# EAGLE design Charger Control Board rev3 (EAGLE 9.5.2)
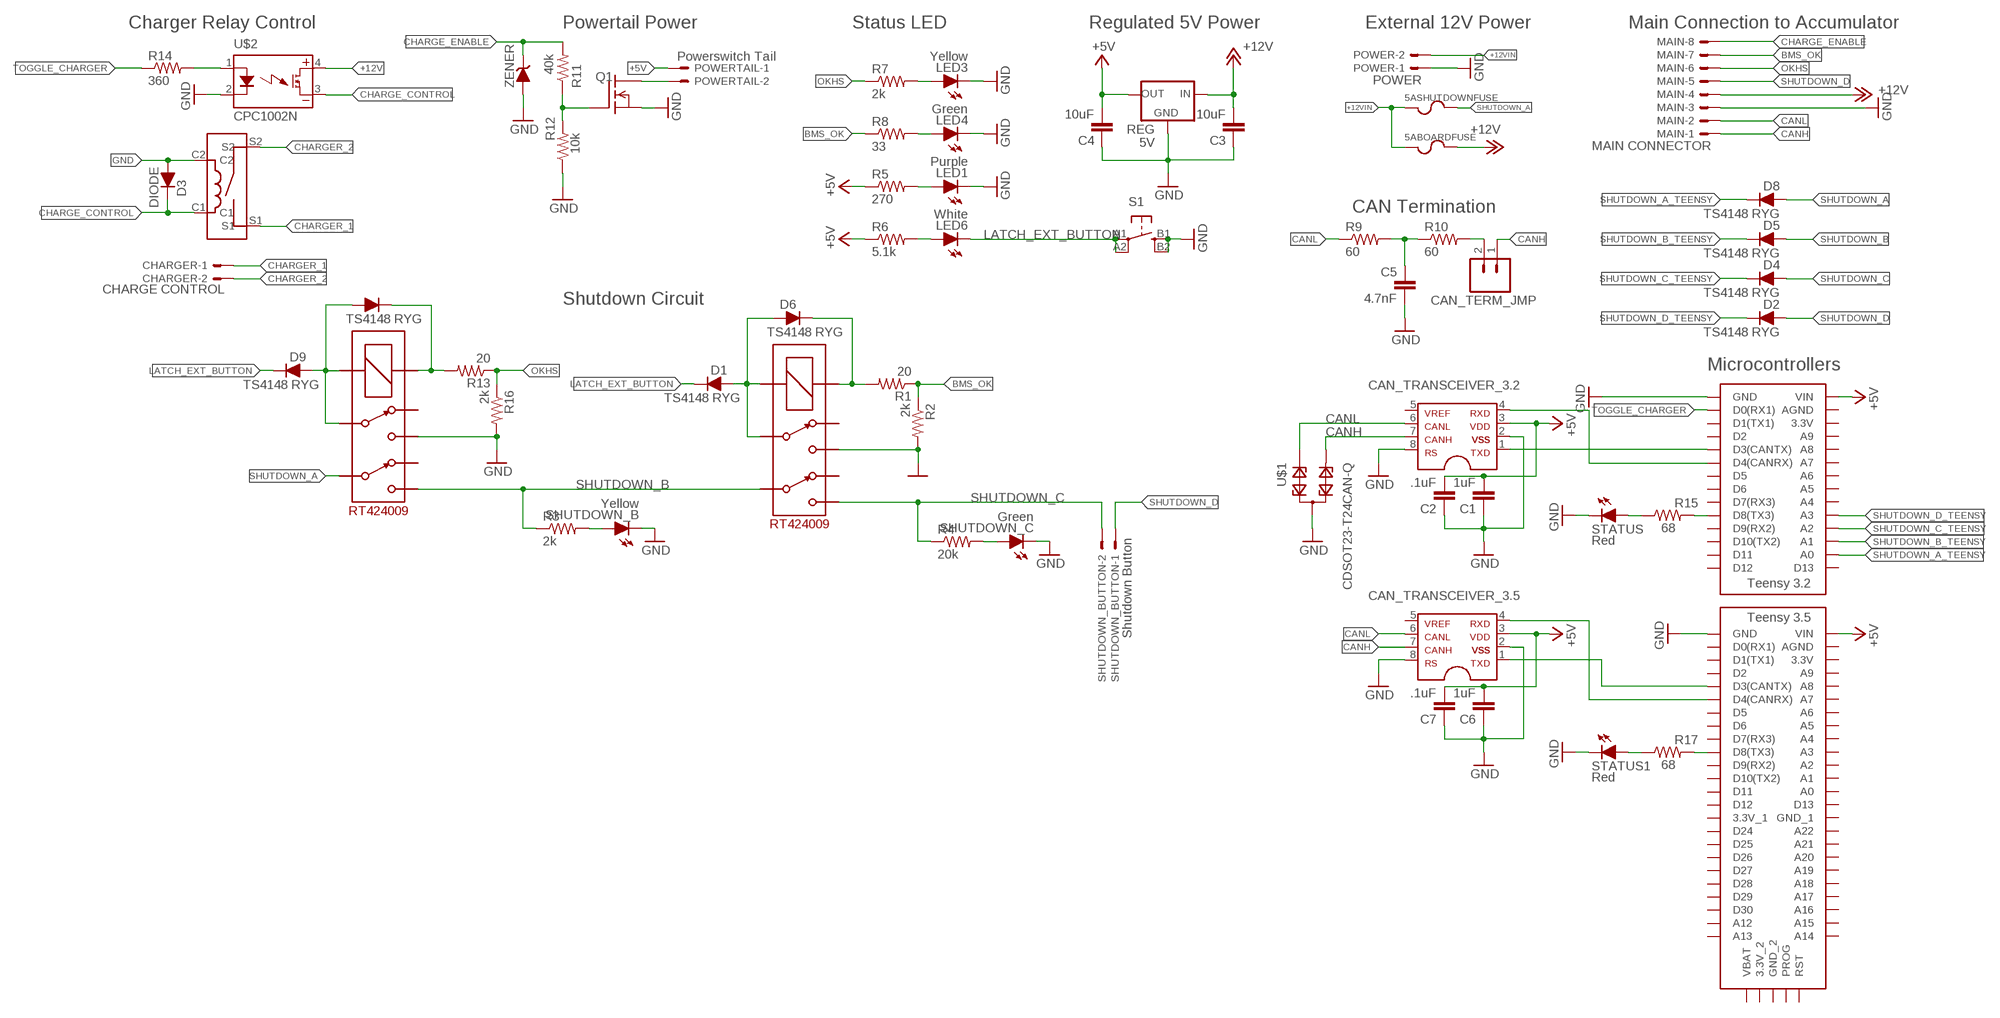
[diagram p0: schematic, sheet 1]

## Parts
5ABOARDFUSE  FUSE_MINIBLADE  [MINI-BLADE_FUSE_HOLDER]
5ASHUTDOWNFUSE  FUSE_MINIBLADE  [MINI-BLADE_FUSE_HOLDER]
BMS_SHUTDOWN_RLY  RT424009  [RELAY_DPDT]
C1  1uF  CAP0805  [0805]
C2  .1uF  CAP0805  [0805]
C3  10uF  CAP0805  [0805]
C4  10uF  CAP0805  [0805]
C5  4.7nF  CAP0805  [0805]
C6  1uF  CAP0805  [0805]
C7  .1uF  CAP0805  [0805]
CAN_TERM_JMP  M02_SLIM  [1X02_SLIM]
CAN_TRANSCEIVER_3.2  MCP2551  [SOIC-08]
CAN_TRANSCEIVER_3.5  MCP2551  [SOIC-08]
CHARGER  CHARGE CONTROL  CONNECTOR-2NANO-FIT_VERTICAL-2  [NANO-FIT_VERTICAL-2]
D1  TS4148 RYG  DIODE0805  [0805_D]
D2  TS4148 RYG  DIODE0805  [0805_D]
D3  DIODE  DIODE0805  [0805_D]
D4  TS4148 RYG  DIODE0805  [0805_D]
D5  TS4148 RYG  DIODE0805  [0805_D]
D6  TS4148 RYG  DIODE0805  [0805_D]
D7  TS4148 RYG  DIODE0805  [0805_D]
D8  TS4148 RYG  DIODE0805  [0805_D]
D9  TS4148 RYG  DIODE0805  [0805_D]
IMD_SHUTDOWN_RLY  RT424009  [RELAY_DPDT]
LED1  Purple  LED-0805  [LED-805]
LED3  Yellow  LED-0805  [LED-805]
LED4  Green  LED-0805  [LED-805]
LED6  White  LED-0805  [LED-805]
MAIN  MAIN CONNECTOR  CONNECTOR-8NANO-FIT_VERTICAL-8  [NANO-FIT_VERTICAL-8]
POWER  POWER  CONNECTOR-2NANO-FIT_VERTICAL-2  [NANO-FIT_VERTICAL-2]
POWERTAIL  Powerswitch Tail  CONNECTOR-2NANO-FIT_VERTICAL-2  [NANO-FIT_VERTICAL-2]
Q1  DMG3406LSOT  [SOT23]
R1  20  RESISTOR0805-RES  [0805]
R2  2k  RESISTOR0805-RES  [0805]
R3  2k  RESISTOR0805-RES  [0805]
R4  20k  RESISTOR0805-RES  [0805]
R5  270  RESISTOR0805-RES  [0805]
R6  5.1k  RESISTOR0805-RES  [0805]
R7  2k  RESISTOR0805-RES  [0805]
R8  33  RESISTOR0805-RES  [0805]
R9  60  RESISTOR0805-RES  [0805]
R10  60  RESISTOR0805-RES  [0805]
R11  40k  RESISTOR0805-RES  [0805]
R12  10k  RESISTOR0805-RES  [0805]
R13  20  RESISTOR0805-RES  [0805]
R14  360  RESISTOR0805-RES  [0805]
R15  68  RESISTOR0805-RES  [0805]
R16  2k  RESISTOR0805-RES  [0805]
R17  68  RESISTOR0805-RES  [0805]
REG  5V  OKI-78SR-5  [OKI-78SR]
S1  BTN_10-XXSMD  [TACTILE_SWITCH_SMD_6.2MM_TALL]
SHUTDOWN_B  Yellow  LED-0805  [LED-805]
SHUTDOWN_BUTTON  Shutdown Button  CONNECTOR-2NANO-FIT_VERTICAL-2  [NANO-FIT_VERTICAL-2]
SHUTDOWN_C  Green  LED-0805  [LED-805]
STATUS  Red  LED-0805  [LED-805]
STATUS1  Red  LED-0805  [LED-805]
U$1  CDSOT23-T24CAN-Q  [SOT23]
U$2  CPC1002N  [SOP04]
U$3  KT12-1A-40L-THT  [KT12-1A-40L-THT]
U$4  TEENSY_3.2_SIMPLE  [TEENSY_3.2_SIMPLE]
U$5  TEENSY_3.5_EXT  [TEENSY_3.5_EXT]
ZENER  DIODE_ZENER  [SOT23]

## Nets
+5V: C1.2 C2.2 C4.2 C6.2 C7.2 CAN_TRANSCEIVER_3.2.3 CAN_TRANSCEIVER_3.5.3 POWERTAIL.P$1 R5.1 R6.1 REG.3(OUT) U$4.VIN U$5.VIN
+12V: 5ABOARDFUSE.R1 5ABOARDFUSE.R2 C3.2 MAIN.P$4 REG.1(IN) U$2.4(DC+)
+12VIN: 5ABOARDFUSE.L1 5ABOARDFUSE.L2 5ASHUTDOWNFUSE.L1 5ASHUTDOWNFUSE.L2 POWER.P$2
BMS_OK: MAIN.P$7 R1.1 R2.1 R8.1
BMS_OK_RELAY: BMS_SHUTDOWN_RLY.COIL+ D6.C R1.2
BMS_PWR_STEP: BMS_SHUTDOWN_RLY.3 BMS_SHUTDOWN_RLY.COIL- D1.A D6.A
CANH: CAN_TERM_JMP.1 CAN_TRANSCEIVER_3.2.7 CAN_TRANSCEIVER_3.5.7 MAIN.P$1 U$1.2
CANL: CAN_TRANSCEIVER_3.2.6 CAN_TRANSCEIVER_3.5.6 MAIN.P$2 R9.1 U$1.1
CHARGE_CONTROL: D3.C U$2.3(DC-) U$3.C1
CHARGE_ENABLE: MAIN.P$8 R11.2 ZENER.3(C)
CHARGER_1: CHARGER.P$1 U$3.S1
CHARGER_2: CHARGER.P$2 U$3.S2
GND: C1.1 C2.1 C3.1 C4.1 C5.2 C6.1 C7.1 CAN_TRANSCEIVER_3.2.2 CAN_TRANSCEIVER_3.2.8 CAN_TRANSCEIVER_3.5.2 CAN_TRANSCEIVER_3.5.8 D3.A LED1.C LED3.C LED4.C MAIN.P$3 POWER.P$1 Q1.2(S) R12.1 REG.2(GND) S1.B1(S) S1.B2(S1) SHUTDOWN_B.C SHUTDOWN_C.C STATUS1.C STATUS.C U$1.3 U$2.2(CONTROL-) U$3.C2 U$4.GND U$5.GND ZENER.1(A)
IMD_PWR_STEP: D7.A D9.A IMD_SHUTDOWN_RLY.3 IMD_SHUTDOWN_RLY.COIL-
LATCH_EXT_BUTTON: D1.C D9.C LED6.C S1.A1(P) S1.A2(P1)
N$1: POWERTAIL.P$2 Q1.3(D)
N$2: LED6.A R6.2
N$3: LED4.A R8.2
N$4: CAN_TRANSCEIVER_3.5.4 U$5.D4(CANRX)
N$5: Q1.1(G) R11.1 R12.2
N$6: CAN_TRANSCEIVER_3.5.1 U$5.D3(CANTX)
N$7: R17.1 STATUS1.A
N$8: R15.1 STATUS.A
N$9: R17.2 U$5.D8(TX3)
N$10: R14.2 U$2.1(CONTROL+)
N$11: R15.2 U$4.D8(TX3)
N$12: D7.C IMD_SHUTDOWN_RLY.COIL+ R13.2
N$15: CAN_TRANSCEIVER_3.2.4 U$4.D4(CANRX)
N$17: CAN_TERM_JMP.2 R10.2
N$19: R3.2 SHUTDOWN_B.A
N$22: CAN_TRANSCEIVER_3.2.1 U$4.D3(CANTX)
N$26: LED3.A R7.2
N$29: LED1.A R5.2
N$32: R4.2 SHUTDOWN_C.A
N$60: BMS_SHUTDOWN_RLY.4 IMD_SHUTDOWN_RLY.4 R2.2 R16.2 ; supply symbol labelled GND
N$62: C5.1 R9.2 R10.1
OKHS: MAIN.P$6 R7.1 R13.1 R16.1
SHUTDOWN_A: 5ASHUTDOWNFUSE.R1 5ASHUTDOWNFUSE.R2 D8.A IMD_SHUTDOWN_RLY.6
SHUTDOWN_A_TEENSY: D8.C U$4.A0
SHUTDOWN_B: BMS_SHUTDOWN_RLY.6 D5.A IMD_SHUTDOWN_RLY.5 R3.1
SHUTDOWN_B_TEENSY: D5.C U$4.A1
SHUTDOWN_C: BMS_SHUTDOWN_RLY.5 D4.A R4.1 SHUTDOWN_BUTTON.P$2
SHUTDOWN_C_TEENSY: D4.C U$4.A2
SHUTDOWN_D: D2.A MAIN.P$5 SHUTDOWN_BUTTON.P$1
SHUTDOWN_D_TEENSY: D2.C U$4.A3
TOGGLE_CHARGER: R14.1 U$4.D0(RX1)
Unconnected: BMS_SHUTDOWN_RLY.2 BMS_SHUTDOWN_RLY.7 CAN_TRANSCEIVER_3.2.5 CAN_TRANSCEIVER_3.5.5 IMD_SHUTDOWN_RLY.2 IMD_SHUTDOWN_RLY.7 U$4.3.3V U$4.A4 U$4.A5 U$4.A6 U$4.A7 U$4.A8 U$4.A9 U$4.AGND U$4.D1(TX1) U$4.D2 U$4.D5 U$4.D6 U$4.D7(RX3) U$4.D9(RX2) U$4.D10(TX2) U$4.D11 U$4.D12 U$4.D13 U$5.3.3V U$5.3.3V_1 U$5.3.3V_2 U$5.A0 U$5.A1 U$5.A2 U$5.A3 U$5.A4 U$5.A5 U$5.A6 U$5.A7 U$5.A8 U$5.A9 U$5.A12 U$5.A13 U$5.A14 U$5.A15 U$5.A16 U$5.A17 U$5.A18 U$5.A19 U$5.A20 U$5.A21 U$5.A22 U$5.AGND U$5.D0(RX1) U$5.D1(TX1) U$5.D2 U$5.D5 U$5.D6 U$5.D7(RX3) U$5.D9(RX2) U$5.D10(TX2) U$5.D11 U$5.D12 U$5.D13 U$5.D24 U$5.D25 U$5.D26 U$5.D27 U$5.D28 U$5.D29 U$5.D30 U$5.GND_1 U$5.GND_2 U$5.PROG U$5.RST U$5.VBAT

## Notes on the sheet
- Charger Relay Control | Powertail Power | Status LED | Regulated 5V Power | External 12V Power | Main Connection to Accumulator
- CAN Termination
- Shutdown Circuit
- Microcontrollers

## Library data of the parts
5ABOARDFUSE 5ASHUTDOWNFUSE = HyTechDevices:FUSE: Fuse/Fuseclips Keystone Electronics 3568 Fuse Mouser Part <http://www.mouser.com/ProductDetail/Keystone-Electronics/3568> Datasheet <http://www.mouser.com/ds/2/215/568-742601.pdf> Bussman/Eaton Midget Fuse Clip 1A3400 <http://www.mouser.com/ProductDetail/Bussmann-Eaton/BK-1A3400-09-R/?qs=sGAEpiMZZMuG%252bgnN5hGYGzzlAelq2OxnKqVSMVjq8I4%3d> Schurter 0751.0110 Brass Fuse Clip Datasheet <http://www.mouser.com/ds/2/358/typ_OG__Clip__5x20-2553.pdf>; RATING: 5A
BMS_SHUTDOWN_RLY IMD_SHUTDOWN_RLY = HyTechDevices:RT424009: TE/Schrack Double Pull Double Throw Relay 9VDC Datasheet <https://www.mouser.com/datasheet/2/418/NG_DS_RT2_1014-736201.pdf> Product Page <https://www.te.com/usa-en/product-6-1393243-2.html>
C1 C2 C6 C7 = HyTechDevices:CAP: Capacitor Standard 0603 ceramic capacitor, and 0.1" leaded capacitor.; TOLERANCE: 5%; VOLTAGE: 10V
C3 = HyTechDevices:CAP: Capacitor Standard 0603 ceramic capacitor, and 0.1" leaded capacitor.; TOLERANCE: 1%; VOLTAGE: 25V
C4 = HyTechDevices:CAP: Capacitor Standard 0603 ceramic capacitor, and 0.1" leaded capacitor.; TOLERANCE: 5%; VOLTAGE: 25V
C5 = HyTechDevices:CAP: Capacitor Standard 0603 ceramic capacitor, and 0.1" leaded capacitor.; TOLERANCE: 5%; VOLTAGE: 50V
CAN_TERM_JMP = HyTechDevices:M02: Standard 2-pin 0.1" header. NOTES ON THE VARIANTS LOCK and LOCK_LONGPADS... This footprint was designed to help hold the alignment of a through-hole component (i.e. 6-pin header) while soldering it into place. You may notice that each hole has been shifted either up or down by 0.005 of an inch from it's more standard position (which is a perfectly straight line). This slight alteration caused the pins (the squares in the middle) to touch the edges of the holes. Because they are alternating, it causes a "brace" to hold the component in place. 0.005 has proven to be the perfect amount of "off-center" position when using our standard breakaway headers. Although looks a little odd when you look at the bare footprint, once you have a header in there, the alteration is very hard to notice. Also,if you push a header all the way into place, it is covered up entirely on the bottom side. This idea of altering the position of holes to aid alignment will be further integrated into the Sparkfun Library for other footprints. It can help hold any component with 3 or more connection pins. Note: The Sparkfun version includes many other packages including surface mount that may be of future interest. Source: Sparkfun <https://github.com/sparkfun/SparkFun-Eagle-Libraries>
CAN_TRANSCEIVER_3.2 CAN_TRANSCEIVER_3.5 = HyTechDevices:MCP2551: MCP2551 High-Speed CAN Transceiver Product Webpage <https://www.microchip.com/wwwproducts/en/MCP2551> Datasheet <http://ww1.microchip.com/downloads/en/DeviceDoc/21667f.pdf> This device is outdated It is replaced by MCP2561. Comparison Page <https://www.microchip.com/wwwproducts/ProductCompare/MCP2551/MCP2561> Product Webpage <https://www.microchip.com/wwwproducts/en/MCP2561> Datasheet <http://ww1.microchip.com/downloads/en/DeviceDoc/20005167C.pdf>
CHARGER POWER POWERTAIL SHUTDOWN_BUTTON = HyTechDevices:CONNECTOR-2: Mini-Fit Junior connector 2 pole Source: http://www.molex.com
D1-D9 = HyTechDevices:DIODE: DIODE general purpose rectifier
LED1 LED3 LED4 LED6 SHUTDOWN_B SHUTDOWN_C STATUS STATUS1 = HyTechDevices:LED: Light Emitting Diode (LED) Source: Dangerous Prototypes Eagle Library <https://github.com/DangerousPrototypes/Eagle_Part_Library>
MAIN = HyTechDevices:CONNECTOR-8: Mini-Fit Junior connector 8 pole Source: http://www.molex.com
Q1 = HyTechDevices:DMG3406L: Generic NPN MOSFET DMG3406L (SOT-23, 2.8 A 30V)
R1-R17 = HyTechDevices:RESISTOR: Resistor Basic schematic elements and footprints for 0603, 1206, and PTH resistors.; TOLERANCE: 1%
REG = HyTechDevices:OKI-78SR-5: Murata OKI-78SR 5V 1.5A Non-Isolated Switching Regulator DC/DC - Datasheet <https://power.murata.com/data/power/oki-78sr.pdf>
S1 = HyTechDevices:BTN_10-XX: Small momentary tactile push button
U$1 = HyTechDevices:CDSOT23-T24CAN-Q: CAN Bus dual TVS array for transceiver ESD and surge protection
U$2 = HyTechDevices:CPC1002N: IXYS Solid State Relay .7A
U$3 = HyTechDevices:KT12-1A-40L-THT
U$4 = HyTechDevices:TEENSY_3.2_SIMPLE: Simple version of the Teensy 3.2 board that only uses the 2 main rows of pins, not the inner pins or the pins opposite the usb port.
U$5 = HyTechDevices:TEENSY_3.5_EXT: Simple version of the Teensy 3.5 board that only uses the 2 main rows of pins, plus the perpendicular row with VBat.
ZENER = HyTechDevices:DIODE_ZENER: ZENER DIODE

## Board
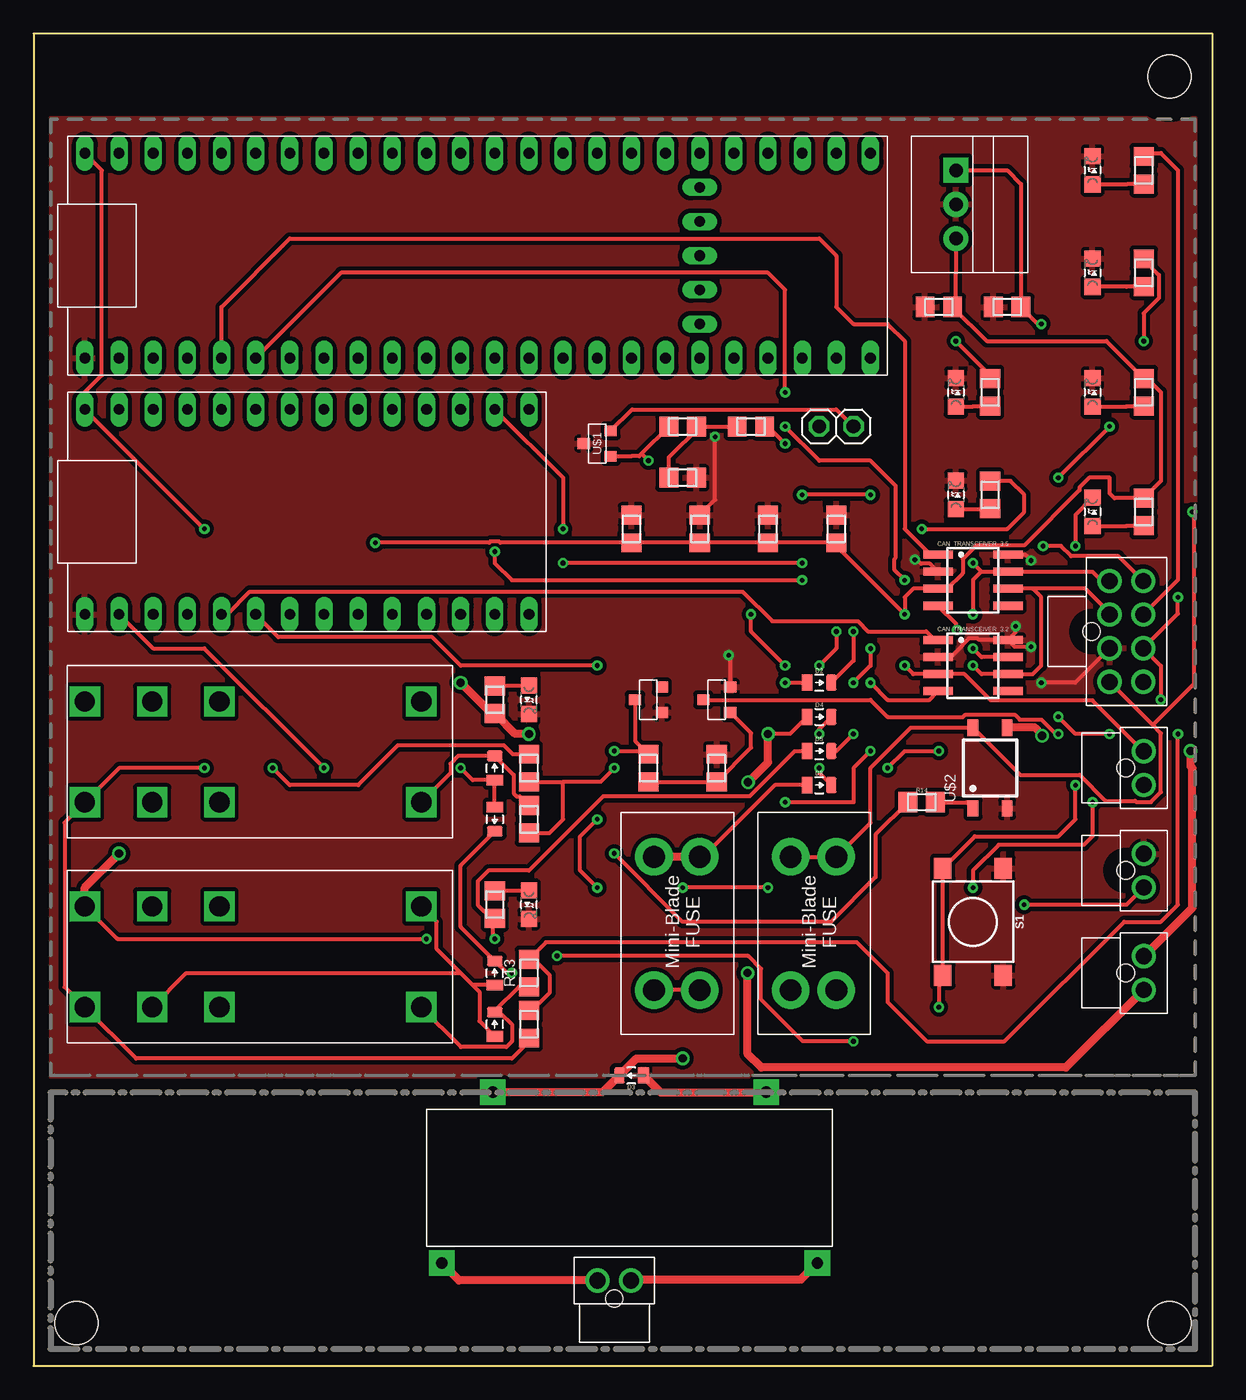
[diagram p1: board, top side]
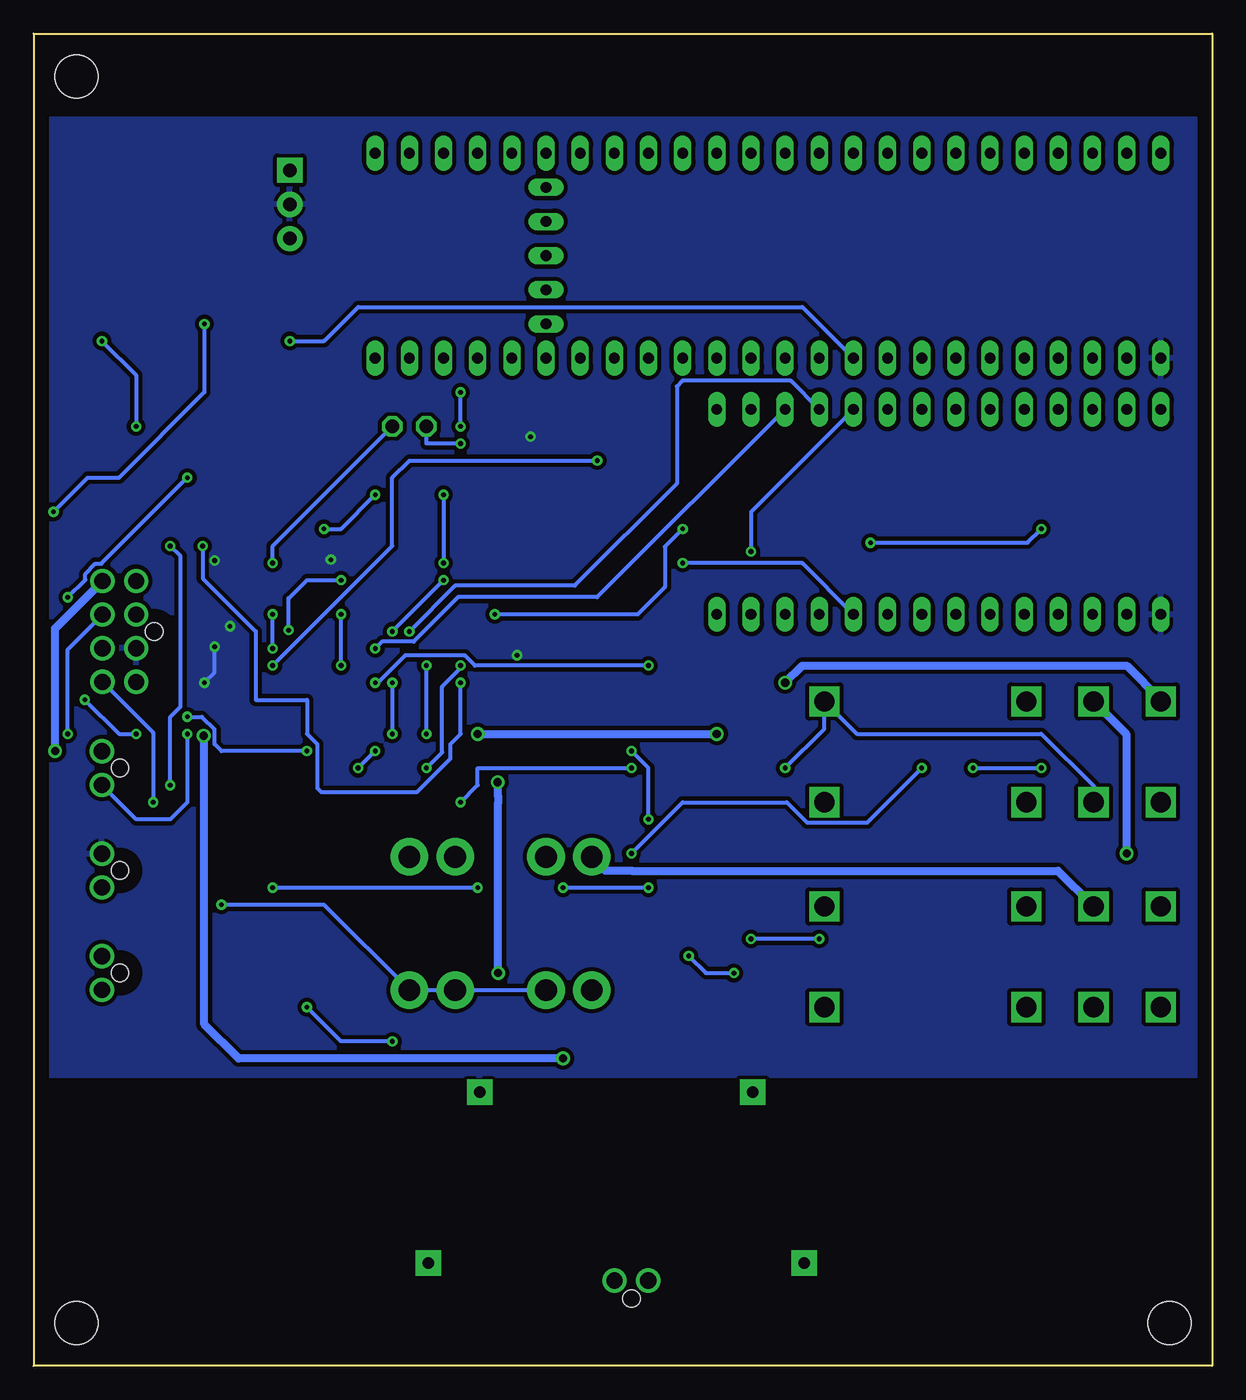
[diagram p2: board, bottom side, seen from below]

Size 87.63 x 99.06 mm. Coordinates in mm from the lower left corner, seen from the top.
Outline: 87.63,99.06 0,99.06 0,0 87.63,0 87.63,99.06
Copper layers (1*16): Top 0.035mm / dielectric 1.5mm / Bottom 0.035mm
Design rules "DRC Advanced Circuits *": minimum track width 6mil, minimum drill 10mil, track to track 6mil, track to pad 6mil, pad to pad 6mil, via to via 6mil, smd to smd 6mil, copper to edge 40mil, drill to drill 6mil, minimum pad ring 10mil, minimum via ring 8mil, stop-mask expansion 4mil, vias tented up to drill 0mil, thermal gap 10mil
Holes 3.2 mm at 84.45,95.89 3.17,3.18 84.45,3.18
tKeepout: area 81.5,92.9 to 87.5,98.9; area 0.2,0.2 to 6.2,6.2; area 81.5,0.2 to 87.5,6.2
tRestrict: area 81.5,92.9 to 87.5,98.9; area 0.2,0.2 to 6.2,6.2; area 81.5,0.2 to 87.5,6.2

### Footprints (pad centres in the part's own frame; a part is rotated, then mirrored left to right if it is on the bottom)
MINI-BLADE_FUSE_HOLDER = drill 1.613 pad 2.794: L1 0,3.404; L2 0,0; R1 9.906,3.404; R2 9.906,0
RELAY_DPDT = drill 1.5 square: 2 10.008,0; 3 5.004,0; 4 0,0; 5 0,7.493; 6 5.004,7.493; 7 10.008,7.493; COIL+ 25.019,0; COIL- 25.019,7.493
0805 = smd 1.4 x 1.5: 1 -1.025,0; 2 1.025,0
1X02_SLIM = drill 1.016 octagon: 1 -1.27,0; 2 1.27,0
SOIC-08 = smd 0.6 x 2.2: 1 -1.905,-2.6; 2 -0.635,-2.6; 3 0.635,-2.6; 4 1.905,-2.6; 5 1.905,2.6; 6 0.635,2.6; 7 -0.635,2.6; 8 -1.905,2.6
NANO-FIT_VERTICAL-2 = drill 1.2: P$1 -1.25,0; P$2 1.25,0 | hole 1.3: 0,-1.34
0805_D = smd 0.8 x 1.2: A -0.9,0; C 0.9,0
LED-805 = smd 1.2 x 1.2: A 0,-1.05; C 0,1.05
NANO-FIT_VERTICAL-8 = drill 1.2: P$1 -3.75,0; P$2 -1.25,0; P$3 1.25,0; P$4 3.75,0; P$5 -3.75,2.5; P$6 -1.25,2.5; P$7 1.25,2.5; P$8 3.75,2.5 | hole 1.3: 0,-1.34
SOT23 = smd 0.8 x 0.9: 1 -0.95,-1; 2 0.95,-1; 3 0,1
OKI-78SR = drill 1 pad 1.88 square: 1 -2.54,0 | drill 1 pad 1.88: 2 0,0; 3 2.54,0
TACTILE_SWITCH_SMD_6.2MM_TALL = smd 1.55 x 1.3: A1 -3.975,-2.25; A2 3.975,-2.25; B1 -3.975,2.25; B2 3.975,2.25
SOP04 = smd 0.8 x 1.2: 1 -1.27,-3; 2 1.27,-3; 3 1.27,3; 4 -1.27,3
KT12-1A-40L-THT = drill 0.85 pad 1.9 square: C1 4.95,11.45; C2 25.25,11.45; S1 1.13,-1.25; S2 29.07,-1.25
TEENSY_3.2_SIMPLE = drill 0.8 long: 3.3V 16.51,29.21; A0 16.51,3.81; A1 16.51,6.35; A2 16.51,8.89; A3 16.51,11.43; A4 16.51,13.97; A5 16.51,16.51; A6 16.51,19.05; A7 16.51,21.59; A8 16.51,24.13; A9 16.51,26.67; AGND 16.51,31.75; D0(RX1) 1.27,31.75; D1(TX1) 1.27,29.21; D2 1.27,26.67; D3(CANTX) 1.27,24.13; D4(CANRX) 1.27,21.59; D5 1.27,19.05; D6 1.27,16.51; D7(RX3) 1.27,13.97; D8(TX3) 1.27,11.43; D9(RX2) 1.27,8.89; D10(TX2) 1.27,6.35; D11 1.27,3.81; D12 1.27,1.27; D13 16.51,1.27; GND 1.27,34.29; VIN 16.51,34.29
TEENSY_3.5_EXT = drill 0.8 long: 3.3V 16.51,54.61; 3.3V_1 1.27,24.13; 3.3V_2 6.35,13.97; A0 16.51,29.21; A1 16.51,31.75; A2 16.51,34.29; A3 16.51,36.83; A4 16.51,39.37; A5 16.51,41.91; A6 16.51,44.45; A7 16.51,46.99; A8 16.51,49.53; A9 16.51,52.07; A12 1.27,3.81; A13 1.27,1.27; A14 16.51,1.27; A15 16.51,3.81; A16 16.51,6.35; A17 16.51,8.89; A18 16.51,11.43; A19 16.51,13.97; A20 16.51,16.51; A21 16.51,19.05; A22 16.51,21.59; AGND 16.51,57.15; D0(RX1) 1.27,57.15; D1(TX1) 1.27,54.61; D2 1.27,52.07; D3(CANTX) 1.27,49.53; D4(CANRX) 1.27,46.99; D5 1.27,44.45; D6 1.27,41.91; D7(RX3) 1.27,39.37; D8(TX3) 1.27,36.83; D9(RX2) 1.27,34.29; D10(TX2) 1.27,31.75; D11 1.27,29.21; D12 1.27,26.67; D13 16.51,26.67; D24 1.27,21.59; D25 1.27,19.05; D26 1.27,16.51; D27 1.27,13.97; D28 1.27,11.43; D29 1.27,8.89; D30 1.27,6.35; GND 1.27,59.69; GND_1 16.51,24.13; GND_2 8.89,13.97; PROG 11.43,13.97; RST 13.97,13.97; VBAT 3.81,13.97; VIN 16.51,59.69

### Placement (x,y rotation side)
5ABOARDFUSE  59.69,27.94 90 top
5ASHUTDOWNFUSE  49.53,27.94 90 top
BMS_SHUTDOWN_RLY  3.81,41.91 0 top
C1  49.53,62.23 270 top
C2  44.45,62.23 270 top
C3  72.39,78.74 0 top
C4  67.31,78.74 0 top
C5  48.26,66.04 0 top
C6  59.69,62.23 270 top
C7  54.61,62.23 270 top
CAN_TERM_JMP  59.69,69.85 180 top
CAN_TRANSCEIVER_3.2  69.85,52.07 270 top
CAN_TRANSCEIVER_3.5  69.85,58.42 270 top
CHARGER  43.18,6.35 0 top
D1  34.29,40.64 270 top
D2  58.42,50.8 0 top
D3  44.45,21.59 180 top
D4  58.42,48.26 0 top
D5  58.42,45.72 0 top
D6  34.29,44.45 90 top
D7  34.29,25.4 90 top
D8  58.42,43.18 0 top
D9  34.29,29.21 90 top
IMD_SHUTDOWN_RLY  3.81,26.67 0 top
LED1  78.74,72.39 0 top
LED3  78.74,88.9 0 top
LED4  78.74,81.28 0 top
LED6  78.74,63.5 0 top
MAIN  80.01,54.61 270 top
POWER  82.55,36.83 270 top
POWERTAIL  82.55,44.45 270 top
Q1  50.8,49.53 90 top
R1  36.83,40.64 90 top
R2  36.83,44.45 90 top
R3  34.29,34.29 90 top
R4  34.29,49.53 90 top
R5  82.55,72.39 270 top
R6  82.55,63.5 270 top
R7  82.55,88.9 270 top
R8  82.55,81.28 270 top
R9  48.26,69.85 0 top
R10  53.34,69.85 0 top
R11  45.72,44.45 90 top
R12  50.8,44.45 270 top
R13  36.83,29.21 270 top
R14  66.04,41.91 0 top
R15  71.12,64.77 90 top
R16  36.83,25.4 270 top
R17  71.12,72.39 90 top
REG  68.58,86.36 270 top
S1  69.85,33.02 270 top
SHUTDOWN_B  36.83,34.29 180 top
SHUTDOWN_BUTTON  82.55,29.21 270 top
SHUTDOWN_C  36.83,49.53 180 top
STATUS  68.58,64.77 0 top
STATUS1  68.58,72.39 0 top
U$1  41.91,68.58 90 top
U$2  71.12,44.45 0 top
U$3  29.21,8.89 0 top
U$4  38.1,54.61 90 top
U$5  63.5,73.66 90 top
ZENER  45.72,49.53 90 top

### Tracks (layer width: path | path; a pad name or v marks a point on that pad's centre or on a via)
+5V  (via drill 0.35)
  Top 0.305: REG.3 68.58,81.28 68.58,78.98 C4.2 70.88,76.2 79.77,76.2 R5.1 82.8,73.42 83.82,72.39 83.82,65.8 R6.1 80.36,64.53 80.01,64.88 80.01,66.04 78.49,66.04 77.76,65.31 77.76,65.11 73.66,61.01 70.09,61.01 69.09,60 69.09,58.93 67.94,57.79 CAN_TRANSCEIVER_3.5.3 65.41,57.79 64.77,57.15 v64.77,55.88 59.69,60.96 C6.2 C7.2 C1.2 C2.2 34.71,61.2 34.6,61.31 33.98,61.31 33.87,61.2 v25.4,61.2 | v12.7,62.23 U$4.VIN 3.81,72.39 5.08,73.66 5.08,88.9 U$5.VIN | v64.77,52.07 65.41,51.44 CAN_TRANSCEIVER_3.2.3 69.22,51.44 71.17,49.48 78.73,49.48 82.51,45.7 POWERTAIL.P$1
  Bottom 0.305: v64.77,52.07 v64.77,55.88 | v25.4,61.2 13.72,61.2 v12.7,62.23
+12V  (via drill 0.35)
  Top 0.305: REG.1 72.39,88.9 73.42,87.88 C3.2 74.69,77.47 v74.93,77.47 | 83.22,47.66 83.83,47.04 83.83,42.67 83.08,41.92 82.02,41.92 81.92,42.02 79.7,42.02 77.78,43.94 73.36,43.94 U$2.4 65.23,47.45 62.23,44.45 62.23,40.39 5ABOARDFUSE.R2 5ABOARDFUSE.R1 | 83.22,47.66 86.31,50.75 86.31,63.5 v86.16,63.5 | MAIN.P$4 83.22,47.66
  Bottom 0.305: v74.93,77.47 74.93,72.39 81.28,66.04 83.62,66.04 v86.16,63.5
+12VIN  (via drill 0.35)
  Top 0.305: 5ASHUTDOWNFUSE.L2 5ASHUTDOWNFUSE.L1 | POWER.P$2 81.26,34.29 v73.66,34.29
  Bottom 0.305: 5ASHUTDOWNFUSE.L2 5ABOARDFUSE.L1 5ABOARDFUSE.L2 66.04,34.29 v73.66,34.29
BMS_OK  (via drill 0.35)
  Top 0.305: R1.1 38.34,39.62 39.37,40.64 39.37,43.43 | v63.5,44.45 64.77,45.72 v67.31,45.72 | v62.23,45.72 60.96,44.45 60.96,41.91 v55.88,41.91 | v83.82,49.53 83.82,52.05 MAIN.P$7 85.09,55.94 v85.09,57.15 | R8.1 82.55,82.24 83.68,81.11 83.68,79.4 82.55,78.27 v82.55,76.2 | v80.01,69.85 v76.2,66.04 | v80.01,46.99 77.47,46.99 v76.2,48.26 | R2.1 39.37,43.43 | v43.18,44.45 42.16,43.43 39.37,43.43
  Bottom 0.305: v62.23,45.72 v63.5,44.45 | v67.31,45.72 73.66,45.72 74.17,46.23 74.17,47.3 75.13,48.26 v76.2,48.26 | v55.88,41.91 54.61,43.18 54.61,44.45 v43.18,44.45 | v83.82,49.53 81.28,46.99 v80.01,46.99 | v82.55,76.2 80.01,73.66 v80.01,69.85 | v85.09,57.15 83.79,58.45 83.79,58.89 83.04,59.64 82.6,59.64 v76.2,66.04
BMS_OK_RELAY
  Top 0.305: BMS_SHUTDOWN_RLY.COIL+ 30.99,44.07 30.99,44.76 31.58,45.35 D6.C 35.7,43.94 35.7,42.57 35.92,42.34 36.15,42.34 36.71,41.79 R1.2
BMS_PWR_STEP  (via drill 0.35)
  Top 0.305: D1.A D6.A 32.65,43.55 v31.75,44.45
  Bottom 0.305: v31.75,44.45 28.83,47.37 BMS_SHUTDOWN_RLY.COIL- 26.42,46.99 12.7,46.99 8.81,43.1 BMS_SHUTDOWN_RLY.3
CANH  (via drill 0.35)
  Top 0.305: CAN_TRANSCEIVER_3.2.7 70.48,52.7 v69.85,53.34 | 70.48,59.06 69.85,58.42 v69.85,55.88 | U$1.2 44.5,71.12 59.69,71.12 CAN_TERM_JMP.1 | v69.85,59.69 70.48,59.06 | 70.48,59.06 71.12,59.06 72.39,59.06 CAN_TRANSCEIVER_3.5.7 78.74,59.06 79.44,58.36 MAIN.P$1
  Bottom 0.305: CAN_TERM_JMP.1 69.85,60.96 v69.85,59.69 | v69.85,53.34 v69.85,55.88
CANL  (via drill 0.35)
  Top 0.305: 74.3,57.79 CAN_TRANSCEIVER_3.5.6 | 74.3,57.79 74.93,57.15 74.93,52.07 74.3,51.44 CAN_TRANSCEIVER_3.2.6 70.48,51.44 v69.85,52.07 | U$1.1 44.45,67.63 45.02,67.63 45.21,67.82 | R9.1 45.21,67.82 | v45.72,67.31 45.21,67.82 | 74.3,57.79 78.21,57.79 80.01,55.99 MAIN.P$2
  Bottom 0.305: v69.85,52.07 60.96,60.96 60.96,66.04 59.69,67.31 v45.72,67.31
CHARGE_CONTROL  (via drill 0.61)
  Top 0.305: 34.29,20.34 U$3.C1
  Top 0.61: v48.26,22.86 44.82,22.86 D3.C 42.3,20.34 34.29,20.34 | v74.98,46.86 74.93,46.91 74.93,46.99 74.47,47.45 U$2.3
  Bottom 0.61: v48.26,22.86 72.39,22.86 74.93,25.4 74.93,46.99 74.98,46.94 v74.98,46.86
CHARGE_ENABLE  (via drill 0.35)
  Top 0.305: v78.74,41.91 78.74,39.37 78.11,38.73 71.75,38.73 69.85,36.83 v69.85,35.56 | v54.61,35.56 v48.26,35.56 | v41.91,35.56 40.64,36.83 40.64,39.37 v41.91,40.64 | ZENER.3 44.72,46.48 R11.2 45.48,45.72 v43.18,45.72
  Bottom 0.305: MAIN.P$8 78.74,47.09 v78.74,41.91 | v69.85,35.56 v54.61,35.56 | v48.26,35.56 v41.91,35.56 | v41.91,40.64 41.91,44.45 v43.18,45.72
CHARGER_1
  Top 0.61: U$3.S1 31.63,6.35 CHARGER.P$1
CHARGER_2
  Top 0.305: 57.07,6.43 57.03,6.39 44.48,6.39 CHARGER.P$2
  Top 0.61: U$3.S2 57.07,6.43 44.51,6.43 CHARGER.P$2
GND  (via drill 0.35)
  Top 0.305: CAN_TRANSCEIVER_3.5.8 73.73,60.33 v74.17,59.89 | CAN_TRANSCEIVER_3.5.2 66.66,59.64 65.99,59.64 65.69,59.94 v65.53,59.94 | MAIN.P$3 77.45,50.8 v74.93,50.8 | v74.17,53.47 72.96,53.47 CAN_TRANSCEIVER_3.2.8 | CAN_TRANSCEIVER_3.2.8 73.03,54.55 v73.03,54.99 | CAN_TRANSCEIVER_3.2.8 70.29,53.98 70.16,54.1 69.54,54.1 69.09,53.65 69.09,53.6 68.2,52.7 CAN_TRANSCEIVER_3.2.2 | C1.1 50.67,64.4 v50.67,69.09 | Q1.2 51.8,52.72 v51.69,52.83
  Top 0.61: D3.A 46.62,20.32 54.44,20.32 U$3.C2
  Bottom 0.305: v74.93,50.8 74.17,51.56 v74.17,53.47 | v50.67,69.09 50.8,68.96 | v51.69,52.83 51.69,52.96
  pour Bottom (isolate 0.305): 1.27,92.71 1.27,21.59 86.36,21.59 86.36,92.71
  pour Top (isolate 0.305): 1.27,92.71 1.27,21.59 86.36,21.59 86.36,92.71
IMD_PWR_STEP
  Top 0.305: D7.A 33.14,25.65 33.14,27.82 32.65,28.31 | 31.75,29.21 32.65,28.31 | 31.75,29.21 29.97,30.99 29.97,33.02 IMD_SHUTDOWN_RLY.COIL- | IMD_SHUTDOWN_RLY.3 11.35,29.21 31.75,29.21 | D9.A 32.65,28.31
LATCH_EXT_BUTTON  (via drill 0.35)
  Top 0.305: v77.47,43.18 77.47,40.64 76.2,39.37 69.97,39.37 S1.A1 S1.A2 67.31,28.76 v67.31,26.67 | v60.96,24.13 57.2,24.13 54.1,27.23 54.1,29.52 53.14,30.48 v38.92,30.48 | v35.56,29.21 35.19,29.21 D9.C 31.75,32.65 31.75,37.2 D1.C | LED6.C 77.47,63.28 v77.47,60.96
  Bottom 0.305: v60.96,24.13 64.77,24.13 v67.31,26.67 | v38.92,30.48 37.65,29.21 v35.56,29.21 | v77.47,43.18 77.47,48.26 76.71,49.02 76.71,60.2 v77.47,60.96
N$1  (via drill 0.35)
  Top 0.305: Q1.3 62.23,49.53 63.5,48.26 69.12,48.26 69.29,48.43 72.95,48.43 73.32,48.06 74.93,48.06 76,46.99 v76.2,46.99
  Bottom 0.305: v76.2,46.99 76.2,41.91 77.47,40.64 79.99,40.64 POWERTAIL.P$2
N$2
  Top 0.305: LED6.A 81.28,62.45 82.53,62.45 R6.2
N$3
  Top 0.305: LED4.A 81.28,80.23 82.53,80.23 R8.2
N$4  (via drill 0.35)
  Top 0.305: v55.88,69.85 58.42,67.31 62.23,67.31 64.11,65.43 64.11,60.11 64.01,60 64.01,59.18 v64.77,58.42 | CAN_TRANSCEIVER_3.5.4 68.58,55.19 68.58,54.61 v68.67,54.7 | U$5.D4(CANRX) 22.86,81.28 54.61,81.28 55.88,80.01 v55.88,72.39
  Bottom 0.305: v55.88,69.85 v55.88,72.39 | v68.67,54.7 68.67,57.06 67.31,58.42 v64.77,58.42
N$5
  Top 0.305: R11.1 R12.2 53.34,45.97 53.34,47.04 Q1.1
N$6
  Top 0.305: U$5.D3(CANTX) 13.97,78.74 19.05,83.82 58.42,83.82 59.69,82.55 59.69,78.74 60.96,77.47 63.5,77.47 64.77,76.2 64.77,62.23 66.67,60.33 CAN_TRANSCEIVER_3.5.1
N$7
  Top 0.305: STATUS1.A 69.85,71.34 71.09,71.34 R17.1
N$8
  Top 0.305: STATUS.A 71.09,63.72 R15.1
N$9  (via drill 0.35)
  Top 0.305: v68.58,76.2 71.12,73.66 R17.2
  Bottom 0.305: v68.58,76.2 66.04,76.2 63.5,78.74 30.48,78.74 U$5.D8(TX3)
N$10
  Top 0.305: R14.2 69.39,41.91 U$2.1
N$11  (via drill 0.35)
  Top 0.305: v62.23,64.77 v57.15,64.77 | v57.15,59.69 v39.37,59.69 | v66.04,62.23 72.39,62.23 73.66,63.5 73.66,64.77 72.64,65.8 R15.2
  Bottom 0.305: U$4.D8(TX3) 30.48,59.69 v39.37,59.69 | v66.04,62.23 64.77,62.23 v62.23,64.77 | v57.15,64.77 v57.15,59.69
N$12
  Top 0.305: IMD_SHUTDOWN_RLY.COIL+ 31.78,23.72 35.15,23.72 35.56,24.13 35.56,25.4 34.66,26.3 D7.C 34.29,26.38 36.09,28.19 R13.2
N$15  (via drill 0.35)
  Top 0.305: v41.91,52.07 31.75,52.07 29.63,54.19 18.2,54.19 U$4.D4(CANRX) | v62.23,50.8 63.5,49.53 66.61,49.53 CAN_TRANSCEIVER_3.2.4
  Bottom 0.305: v62.23,50.8 62.03,50.8 60,52.83 55.57,52.83 54.81,52.07 v41.91,52.07
N$17  (via drill 0.35)
  Top 0.305: R10.2 54.61,69.85 v55.88,68.58
  Bottom 0.305: v55.88,68.58 58.42,68.58 CAN_TERM_JMP.2
N$19
  Top 0.305: SHUTDOWN_B.A 35.56,35.34 34.31,35.34 R3.2
N$22
  Top 0.305: U$4.D3(CANTX) 14.39,55.88 16.08,57.57 52.73,57.57 54.92,55.37 61.27,55.37 62.03,54.61 66.38,54.61 67.02,53.98 CAN_TRANSCEIVER_3.2.1
N$26
  Top 0.305: LED3.A 81.28,87.85 82.53,87.85 R7.2
N$29
  Top 0.305: LED1.A 81.28,71.34 82.53,71.34 R5.2
N$32
  Top 0.305: R4.2 34.31,50.58 SHUTDOWN_C.A
N$60  (via drill 0.35)
  Top 0.305: R2.2 35.63,45.48 34.98,46.13 27.08,46.13 24.13,43.18 19.05,43.18 v17.78,44.45 | v12.7,44.45 6.35,44.45 BMS_SHUTDOWN_RLY.4 2.3,40.4 2.3,28.18 IMD_SHUTDOWN_RLY.4 7.62,22.86 35.56,22.86 36.83,24.13 R16.2
  Bottom 0.305: v17.78,44.45 v12.7,44.45
N$62
  Top 0.305: 49.53,69.85 52.07,69.85 R10.1 | C5.1 47.23,67.56 49.53,69.85 | R9.2 49.53,69.85
OKHS  (via drill 0.35)
  Top 0.305: v85.09,46.99 85.09,34.29 83.82,33.02 81.08,33.02 72.19,24.13 66.42,24.13 63.5,27.05 63.5,29.21 61.21,31.5 38.09,31.5 R13.1 37.2,30.23 38.35,29.08 38.35,27.72 37.06,26.42 R16.1 | MAIN.P$6 85.09,58.44 85.09,88.9 83.82,90.17 82.8,90.17 R7.1
  Bottom 0.305: v85.09,46.99 85.09,53.28 MAIN.P$6
SHUTDOWN_A
  Top 0.305: D8.A 55.11,43.18 49.78,37.85 5ASHUTDOWNFUSE.R2
  Top 0.61: 5ASHUTDOWNFUSE.R2 5ASHUTDOWNFUSE.R1
  Bottom 0.305: 8.91,34.27 IMD_SHUTDOWN_RLY.6 | 11.46,36.8 11.48,36.83 43.18,36.83
  Bottom 0.61: 5ASHUTDOWNFUSE.R1 45.11,36.83 43.18,36.83 43.16,36.8 11.46,36.8 8.91,34.27
SHUTDOWN_A_TEENSY  (via drill 0.35)
  Top 0.305: U$4.A0 39.37,66.04 v39.37,62.23 | D8.C 58.42,44.08 v58.42,44.45 | v55.88,52.07 53.34,54.61 v53.34,55.88
  Bottom 0.305: v39.37,62.23 40.69,60.91 40.69,57.91 42.73,55.88 v53.34,55.88 | v58.42,44.45 57.25,45.62 57.25,50.5 55.88,51.87 v55.88,52.07
SHUTDOWN_B  (via drill 0.35, 0.61)
  Top 0.305: IMD_SHUTDOWN_RLY.5 6.22,31.75 v29.21,31.75 | D5.A 56.6,45.72 53.22,42.34 42.34,42.34 36.83,36.83 33.82,36.83 33.02,36.03 33.02,34.29 34.05,33.27 34.05,33.02 | v34.29,31.75 34.17,31.87 34.17,33.14 R3.1
  Top 0.457: R3.1 34.05,33.02
  Top 0.61: IMD_SHUTDOWN_RLY.5 3.81,35.56 v6.35,38.1
  Bottom 0.305: v29.21,31.75 v34.29,31.75
  Bottom 0.61: v6.35,38.1 6.35,46.94 BMS_SHUTDOWN_RLY.6
SHUTDOWN_B_TEENSY  (via drill 0.35)
  Top 0.305: v62.23,53.34 62.23,52.07 v60.96,50.8 | v60.96,46.99 59.69,45.72 D5.C
  Bottom 0.305: U$4.A1 45.72,57.15 56.08,57.15 59.38,53.85 61.72,53.85 v62.23,53.34 | v60.96,50.8 v60.96,46.99
SHUTDOWN_C  (via drill 0.61)
  Top 0.305: D4.A 56.25,46.99 v54.61,46.99 | 34.41,48.38 R4.1
  Top 0.61: SHUTDOWN_BUTTON.P$2 76.77,22.18 54.1,22.18 53.09,23.2 v53.09,29.21 | v36.83,46.99 35.8,46.99 34.41,48.38 | R4.1 34.05,48.51 v31.75,50.8 | v53.12,43.4 54.61,44.88 v54.61,46.99
  Bottom 0.305: 3.81,49.53 BMS_SHUTDOWN_RLY.5
  Bottom 0.61: v54.61,46.99 v36.83,46.99 | v31.75,50.8 30.48,52.07 6.35,52.07 3.81,49.53 | v53.09,29.21 53.09,41.91 53.09,42.3 53.09,43.36 v53.12,43.4
SHUTDOWN_C_TEENSY  (via drill 0.35)
  Top 0.305: v59.69,54.61 59.69,53.34 v58.42,52.07 | v58.42,46.99 58.42,47.36 D4.C
  Bottom 0.305: U$4.A2 31.33,73.24 39.37,73.24 39.8,72.81 39.8,65.61 47.4,58.01 56.29,58.01 v59.69,54.61 | v58.42,46.99 v58.42,52.07
SHUTDOWN_D  (via drill 0.35, 0.61)
  Top 0.305: v75.06,60.96 76.4,60.96 77.16,60.2 80.67,60.2 MAIN.P$5 | v55.88,50.8 D2.A
  Top 0.61: SHUTDOWN_BUTTON.P$1 86.16,34.07 86.16,44.45 86.03,44.58 v86.03,45.72
  Bottom 0.305: v75.06,60.96 75.06,58.55 71.12,54.61 71.12,49.53 67.31,49.53 67.31,46.99 66.55,46.23 66.55,42.97 66.25,42.67 59.12,42.67 56.64,45.15 56.64,46.23 55.88,46.99 v55.88,50.8
  Bottom 0.61: v86.03,45.72 86.03,54.84 MAIN.P$5
SHUTDOWN_D_TEENSY  (via drill 0.35)
  Top 0.305: v60.96,54.61 60.96,52.44 D2.C | v34.29,60.55 34.29,59.69 35.56,58.42 v57.15,58.42
  Bottom 0.305: v57.15,58.42 v60.96,54.61 | U$4.A3 34.29,63.5 v34.29,60.55
TOGGLE_CHARGER  (via drill 0.35)
  Top 0.305: R14.1 62.61,39.51 62.61,36.35 59.28,33.02 48.26,33.02 v43.18,38.1 | v21.59,44.45 12.7,53.34 8.89,53.34 U$4.D0(RX1)
  Bottom 0.305: v43.18,38.1 39.37,41.91 31.62,41.91 30.11,40.4 25.64,40.4 v21.59,44.45

### Text on the board
tDocu: HS_OK | BMS_OK | 3_5 | Teensy | PWR_5V | 3_3 | Teensy | LATCH | Main | Power_Tail | Power | LATCH_EXT_BUTTON | Shutdown | Button | GLV | GLV | TS | TS | Charger Control Board / rev3 / Designed by: / Arvind Srinivasan / Fengrui Zuo